# EAGLE schematic Dual Motor Module (EAGLE 6.2)
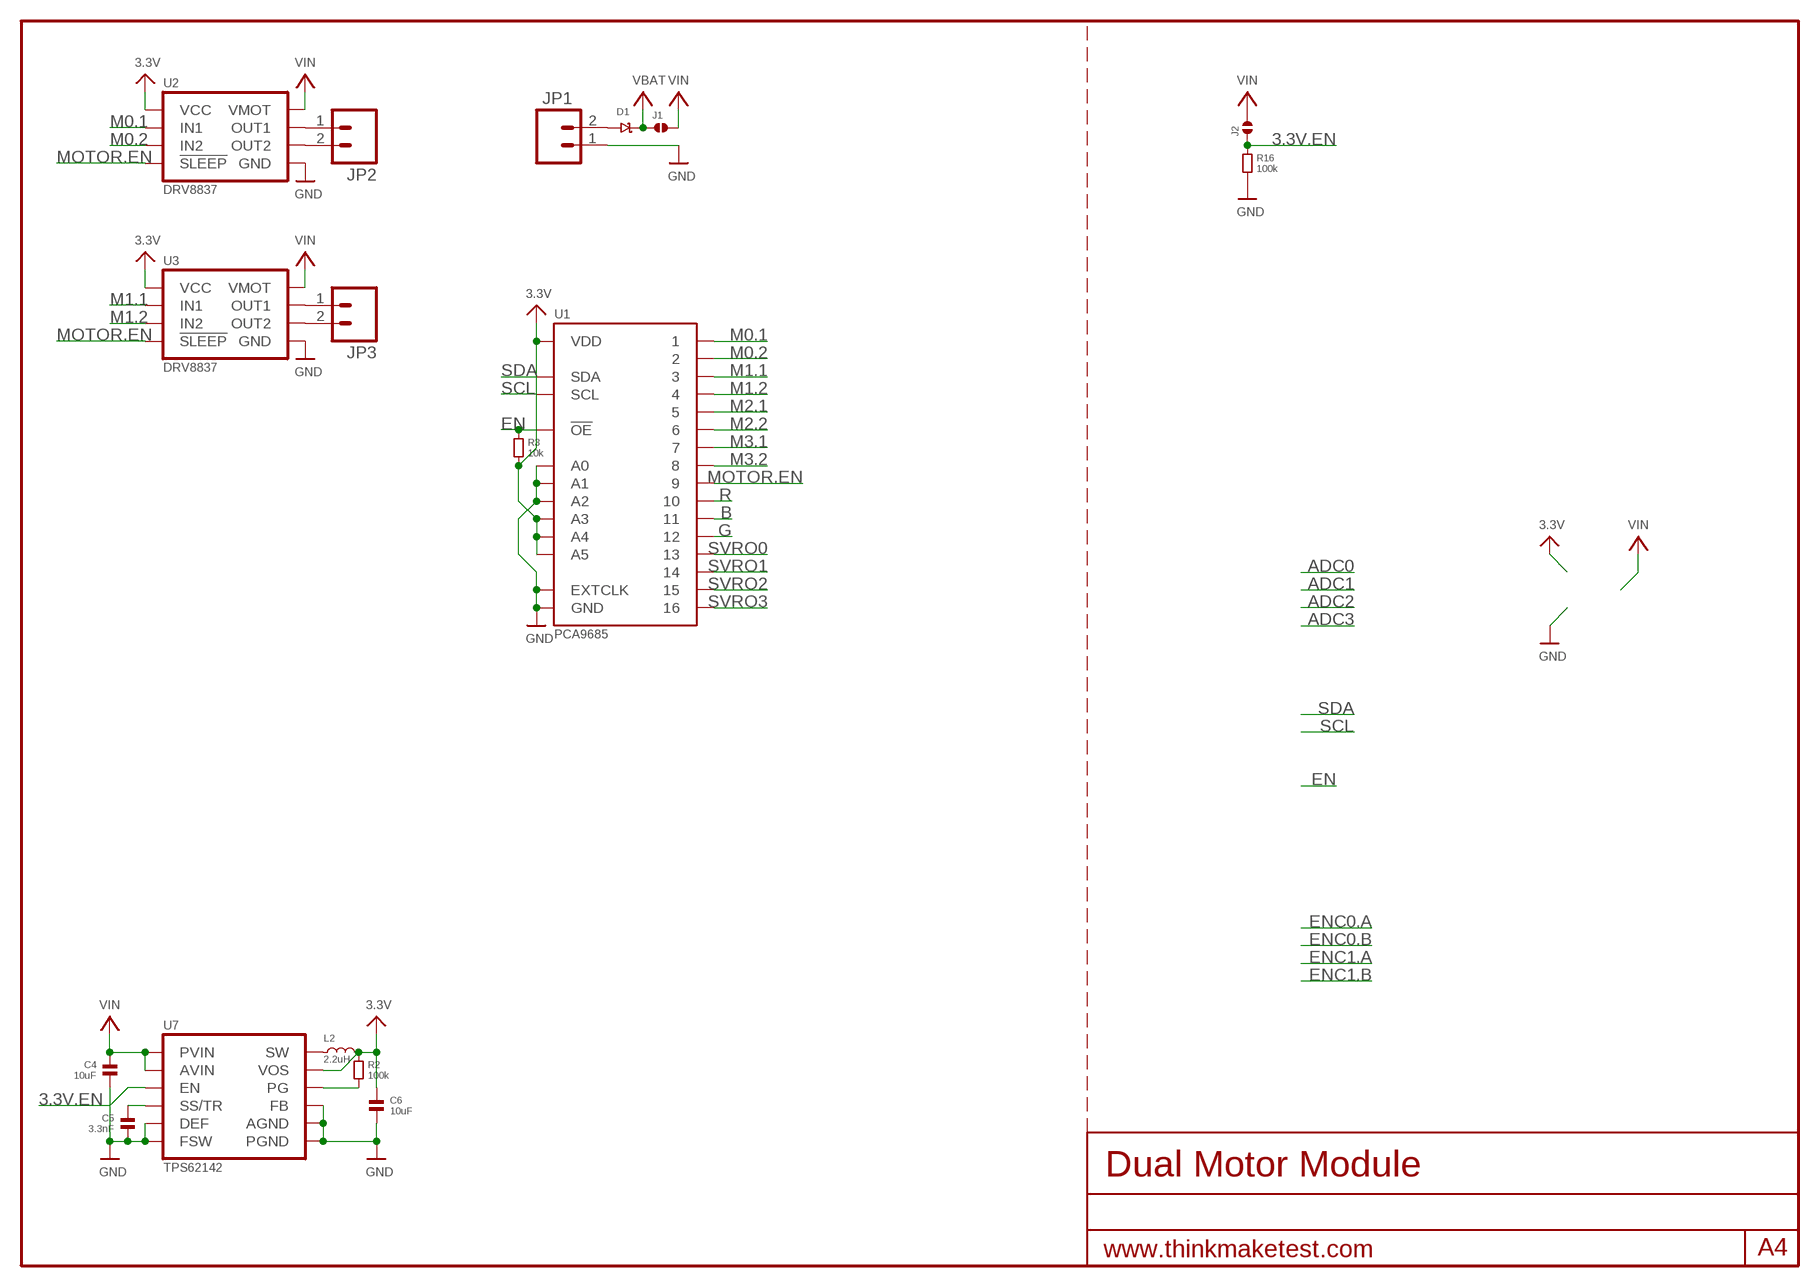
[diagram p0: schematic, sheet 1]

## Parts
C4  10uF  CAPACITOR.0805  [0805]
C5  3.3nF  CAPACITOR.0603  [0603]
C6  10uF  CAPACITOR.0805  [0805]
D1  DIODE[SCHOTKY]-SOD123W  [SOD123W]
J1  SOLDERJUMPER.2.XL  [2.XL]
J2  SOLDERJUMPER.2.LRG.PASTE  [2.LRG.PASTE]
JP1  M023.5MM  [SCREWTERMINAL-3.5MM-2]
JP2  M023.5MM  [SCREWTERMINAL-3.5MM-2]
JP3  M023.5MM  [SCREWTERMINAL-3.5MM-2]
L2  2.2uH  INDUCTOR-SRP4020  [SRP4020]
R2  100k  RESISTOR.0603  [0603]
R3  10k  RESISTOR.0603  [0603]
R16  100k  RESISTOR.0603  [0603]
U1  PCA9685  [HVQFN28]
U2  DRV8837  [DSG]
U3  DRV8837  [DSG]
U7  TPS62142  TPS6214X  [RGT]

## Nets
3.3V: C6.1 L2.2 R2.1 R3.2 U1.4(A3) U1.5(A4) U1.24(A5) U1.28(VDD) U2.8(VCC) U3.8(VCC) U7.14(VOS)
3.3V.EN: J2.1 R16.1 U7.13(EN)
B: U1.17
EN: R3.1 U1.23(!OE)
G: U1.18
GND: C4.2 C5.2 C6.2 JP1.1 R16.2 U1.1(A0) U1.2(A1) U1.3(A2) U1.14(GND) U1.25(EXTCLK) U1.PAD(GND) U2.4(GND) U2.PAD(GND) U3.4(GND) U3.PAD(GND) U7.5(FB) U7.6(AGND) U7.7(FSW) U7.8(DEF) U7.15(PGND) U7.16(PGND) U7.PAD(AGND)
M0.1: U1.6 U2.6(IN1)
M0.2: U1.7 U2.5(IN2)
M1.1: U1.8 U3.6(IN1)
M1.2: U1.9 U3.5(IN2)
M2.1: U1.10
M2.2: U1.11
M3.1: U1.12
M3.2: U1.13
MOTOR.EN: U1.15 U2.7(!SLEEP) U3.7(!SLEEP)
N$1: JP2.1 U2.2(OUT1)
N$2: D1.P$1 JP1.2
N$4: JP2.2 U2.3(OUT2)
N$6: JP3.1 U3.2(OUT1)
N$7: JP3.2 U3.3(OUT2)
N$12: L2.1 U7.1(SW) U7.2(SW) U7.3(SW)
N$14: R2.2 U7.4(PG)
N$15: C5.1 U7.9(SS/TR)
R: U1.16
SCL: U1.26(SCL)
SDA: U1.27(SDA)
SVRO0: U1.19
SVRO1: U1.20
SVRO2: U1.21
SVRO3: U1.22
VBAT: D1.P$2 J1.1
VIN: C4.1 J1.2 J2.2 U2.1(VMOT) U3.1(VMOT) U7.10(AVIN) U7.11(PVIN) U7.12(PVIN)

## Library data of the parts
C4-C6 = .standardparts:CAPACITOR
D1 = nxp:DIODE[SCHOTKY]
J1 J2 = .solderjumper:SOLDERJUMPER.2
JP1-JP3 = SparkFun:M02: Header 2 Standard 2-pin 0.1" header. Use with straight break away headers (SKU : PRT-00116), right angle break away headers (PRT-00553), swiss pins (PRT-00743), machine pins (PRT-00117), and female headers (PRT-00115). Molex polarized connector foot print use with SKU : PRT-08233 with associated crimp pins and housings.
L2 = bourns:INDUCTOR
R2 R3 R16 = .standardparts:RESISTOR
U1 = nxp:PCA9685
U2 U3 = .packages(ti):DRV8837
U7 = .packages(ti):TPS6214X